# Altium schematic sheet STM32H750-MotherBoard1.SchDoc
size A4; DocumentNumber: 1; SheetNumber: 1; SheetTotal: 2
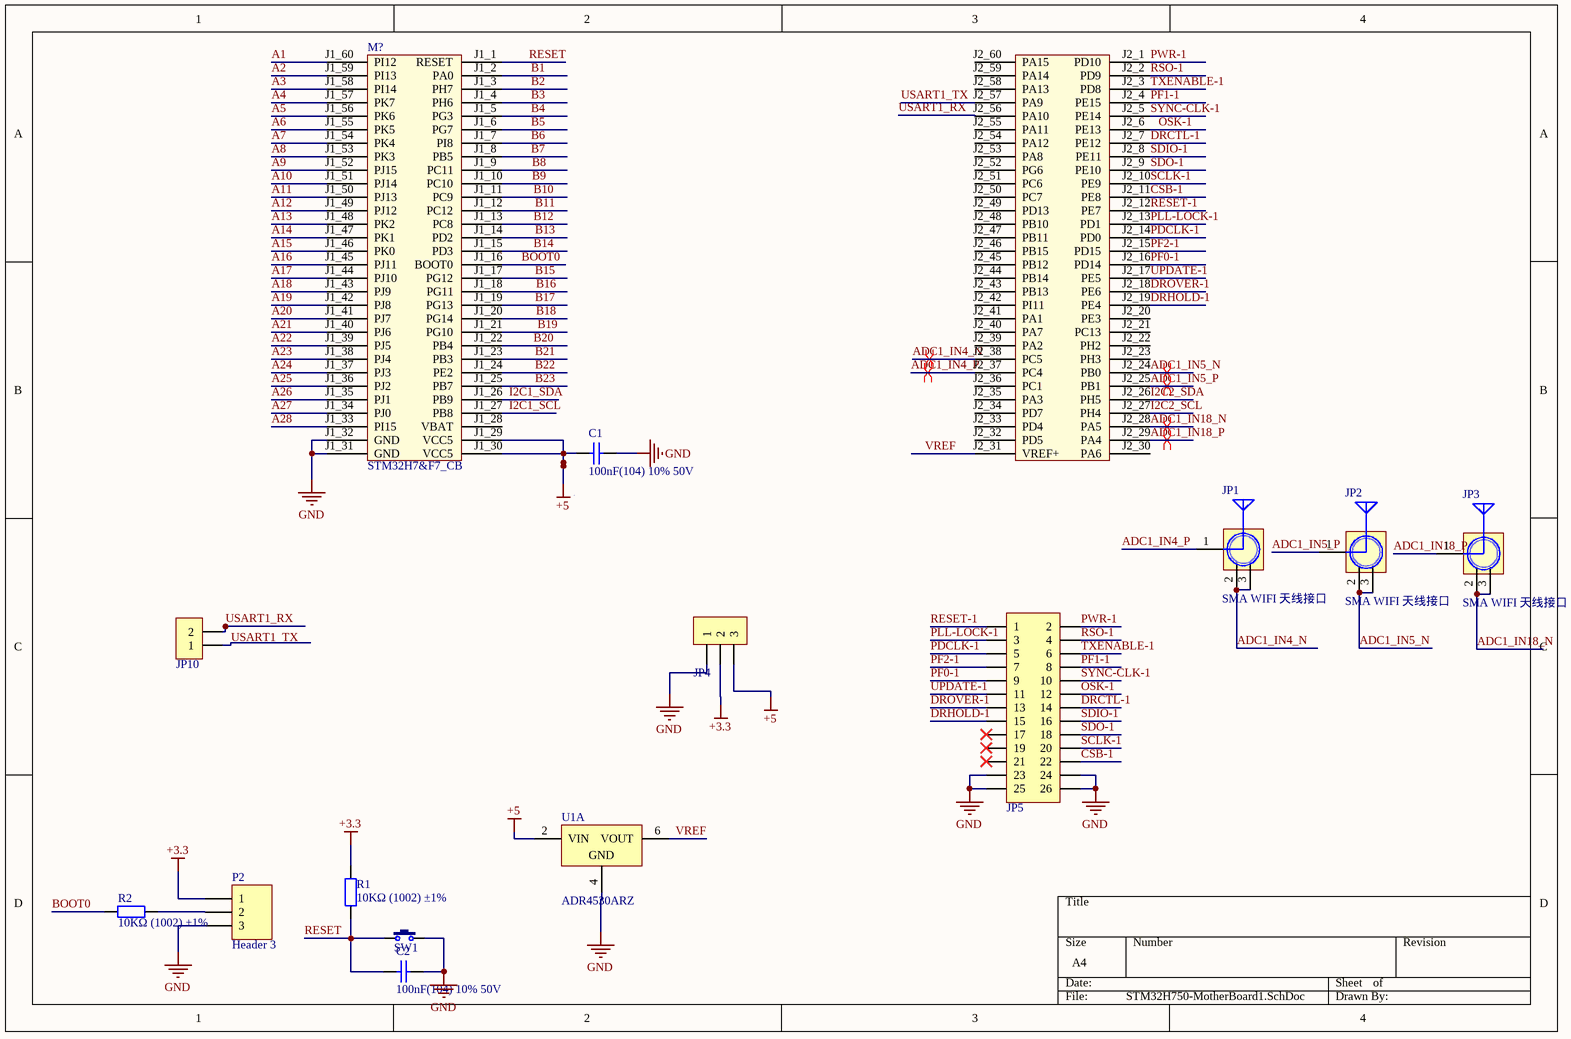
[diagram p0: STM32H750-MotherBoard1.SchDoc]

## Parts
C1  100nF(104) 10% 50V  [0805_C]
C2  100nF(104) 10% 50V  [0805_C]
JP1  SMA WIFI 天线接口  [SMA-KE]
JP2  SMA WIFI 天线接口  [SMA-KE]
JP3  SMA WIFI 天线接口  [SMA-KE]
JP4  HDR-1X3  [XH2.54-WI-3P]  (value not drawn)
JP5  Header 2X11  [IDC2.54-LI-2x13P]  (value not drawn)
JP10  HDR-1X2  [XH2.54-LI-2P]  (value not drawn)
M?  STM32H7&F7_CB  [STM32H7&F7_CB]
P2  Header 3  [HDR1X3]
R1  10KΩ (1002) ±1%  [0805_R]
R2  10KΩ (1002) ±1%  [0805_R]
SW1  3x6x5  [TSW SMD-3*6*2.5]  (value not drawn)
U1  ADR4530ARZ  [ADI-R-8_L]  (part A of 2)

## Nets
+3.3: JP4.2 P2.1 R1.2
+5: C1.2 JP4.3 M?.J1_29(VCC5) M?.J1_30(VCC5) U1.2(VIN)
GND: C1.1 C2.1 JP4.1 JP5.23 JP5.24 JP5.25 JP5.26 M?.J1_31(GND) M?.J1_32(GND) P2.3 SW1.2 U1.4(GND)
A1: M?.J1_60(PI12)
A2: M?.J1_59(PI13)
A3: M?.J1_58(PI14)
A4: M?.J1_57(PK7)
A5: M?.J1_56(PK6)
A6: M?.J1_55(PK5)
A7: M?.J1_54(PK4)
A8: M?.J1_53(PK3)
A9: M?.J1_52(PJ15)
A10: M?.J1_51(PJ14)
A11: M?.J1_50(PJ13)
A12: M?.J1_49(PJ12)
A13: M?.J1_48(PK2)
A14: M?.J1_47(PK1)
A15: M?.J1_46(PK0)
A16: M?.J1_45(PJ11)
A17: M?.J1_44(PJ10)
A18: M?.J1_43(PJ9)
A19: M?.J1_42(PJ8)
A20: M?.J1_41(PJ7)
A21: M?.J1_40(PJ6)
A22: M?.J1_39(PJ5)
A23: M?.J1_38(PJ4)
A24: M?.J1_37(PJ3)
A25: M?.J1_36(PJ2)
A26: M?.J1_35(PJ1)
A27: M?.J1_34(PJ0)
A28: M?.J1_33(PI15)
ADC1_IN4_N: JP1.2(GND) JP1.3(GND) M?.J2_38(PC5)
ADC1_IN4_P: JP1.1(ANT) M?.J2_37(PC4)
ADC1_IN5_N: JP2.2(GND) JP2.3(GND) M?.J2_24(PB0)
ADC1_IN5_P: JP2.1(ANT) M?.J2_25(PB1)
ADC1_IN18_N: JP3.2(GND) JP3.3(GND) M?.J2_28(PA5)
ADC1_IN18_P: JP3.1(ANT) M?.J2_29(PA4)
B1: M?.J1_2(PA0)
B2: M?.J1_3(PH7)
B3: M?.J1_4(PH6)
B4: M?.J1_5(PG3)
B5: M?.J1_6(PG7)
B6: M?.J1_7(PI8)
B7: M?.J1_8(PB5)
B8: M?.J1_9(PC11)
B9: M?.J1_10(PC10)
B10: M?.J1_11(PC9)
B11: M?.J1_12(PC12)
B12: M?.J1_13(PC8)
B13: M?.J1_14(PD2)
B14: M?.J1_15(PD3)
B15: M?.J1_17(PG12)
B16: M?.J1_18(PG11)
B17: M?.J1_19(PG13)
B18: M?.J1_20(PG14)
B19: M?.J1_21(PG10)
B20: M?.J1_22(PB4)
B21: M?.J1_23(PB3)
B22: M?.J1_24(PE2)
B23: M?.J1_25(PB7)
BOOT0: M?.J1_16(BOOT0) R2.1
CSB-1: JP5.22 M?.J2_11(PE8)
DRCTL-1: JP5.14 M?.J2_7(PE12)
DRHOLD-1: JP5.15 M?.J2_19(PE4)
DROVER-1: JP5.13 M?.J2_18(PE6)
I2C1_SCL: M?.J1_27(PB8)
I2C1_SDA: M?.J1_26(PB9)
I2C2_SCL: M?.J2_27(PH4)
I2C2_SDA: M?.J2_26(PH5)
OSK-1: JP5.12 M?.J2_6(PE13)
PDCLK-1: JP5.5 M?.J2_14(PD0)
PF0-1: JP5.9 M?.J2_16(PD14)
PF1-1: JP5.8 M?.J2_4(PE15)
PF2-1: JP5.7 M?.J2_15(PD15)
PLL-LOCK-1: JP5.3 M?.J2_13(PD1)
PWR-1: JP5.2 M?.J2_1(PD10)
RESET: C2.2 M?.J1_1(RESET) R1.1 SW1.1
RESET-1: JP5.1 M?.J2_12(PE7)
RSO-1: JP5.4 M?.J2_2(PD9)
SCLK-1: JP5.20 M?.J2_10(PE9)
SDIO-1: JP5.16 M?.J2_8(PE11)
SDO-1: JP5.18 M?.J2_9(PE10)
SYNC-CLK-1: JP5.10 M?.J2_5(PE14)
TXENABLE-1: JP5.6 M?.J2_3(PD8)
UPDATE-1: JP5.11 M?.J2_17(PE5)
USART1_RX: JP10.2 M?.J2_56(PA10)
USART1_TX: JP10.1 M?.J2_57(PA9)
VREF: M?.J2_31(VREF+) U1.6(VOUT)
NetP2_2: P2.2 R2.2

Not connected (* = marked no-connect by the designer): JP5 17* 19* 21*; M? J1_28(VBAT) J2_20(PE3) J2_21(PC13) J2_22(PH2) J2_23(PH3) J2_30(PA6) J2_32(PD5) J2_33(PD4) J2_34(PD7) J2_35(PA3) J2_36(PC1) J2_39(PA2) J2_40(PA7) J2_41(PA1) J2_42(PI11) J2_43(PB13) J2_44(PB14) J2_45(PB12) J2_46(PB15) J2_47(PB11) J2_48(PB10) J2_49(PD13) J2_50(PC7) J2_51(PC6) J2_52(PG6) J2_53(PA8) J2_54(PA12) J2_55(PA11) J2_58(PA13) J2_59(PA14) J2_60(PA15)

## Layout directives
differential pair: ADC1_IN4_N, ADC1_IN4_P, ADC1_IN5_N, ADC1_IN5_P, ADC1_IN18_N, ADC1_IN18_P

## Library data of the parts
C1 C2 = 0805 100nF(104) 10% 50V: 贴片电容; ComponentLink1Description: 供应商链接; ComponentLink1URL: http://www.szlcsc.com/product/details_50686.html; Package: 0805; Supplier: LC; SuppliersPartNumber: C49678
JP1-JP3 = SMA: SMA-2.4G射频天线接口; BOM名称: SMA-2.4G射频天线接口
JP4 = Header 3: 3P接插件; BOM名称: 3P接插件
JP5 = Header 13X2: 13*2P接插件; BOM名称: 13*2P接插件
JP10 = Header 2: 2P接插件; BOM名称: 2P接插件
M? = STM32H7&F7_CB: H750/F750 Core Board
P2 = Header 3: Header, 3-Pin; LatestRevisionDate: 17-Jul-2002; LatestRevisionNote: Re-released for DXP Platform.; Publisher: Altium Limited
R1 R2 = 0805 10KΩ (1002) 1%: 贴片电阻; ComponentLink1Description: 供应商链接; ComponentLink1URL: http://www.szlcsc.com/product/details_18102.html; Package: 0805; Supplier: LC; SuppliersPartNumber: C17414
SW1 = TSW 3x6: 3x6轻触开关; BOM名称: 3x6轻触开关
U1 = CMP-0784-00168-1: Ultralow Noise, High Accuracy Voltage Reference, 3 V Output, 3 to 15 V Supply, Industrial, 8-pin SOIC (R-8), Tube; Manufacturer: Analog Devices; Vout: 3V; Min V Supply (V): 3; Ref Out TC (ppm/C): 4; Max V Supply (V): 15; Packing: Tube; ComponentLink1Description: Manufacturer URL; Operating Temp Range: -40 to 125 degC; ComponentLink3Description: Package Specification; PackageReference: R-8; ComponentLink1URL: http://www.analog.com/en/index.html; PackageVersion: 060506-A, 06/2006; PartNumber: ADR4530ARZ; Code_JEDEC: MS-012-AA; ComponentLink4URL: Product URL:http://www.analog.com/en/special-linear-functions/voltage-references/adr4530/products/product.html; ComponentLink2URL: http://www.analog.com/static/imported-files/data_sheets/ADR4520_4525_4530_4533_4540_4550.pdf; PackageDescription: 8-Pin Standard Small Outline Package, Body 4.9 x 3.9 mm, Pitch 1.27 mm; ComponentLink2Description: Datasheet; Mounting Technology: Surface Mount; ComponentLink3URL: http://www.analog.com/static/imported-files/packages/PKG_PDF/SOIC_Narrow%20(R)/R_8.pdf; DatasheetVersion: Rev. 0; ComponentLink4Description: URL Link1